# Altium schematic sheet 基于单片机的无线红外防盗报警系统.SchDoc
size A4
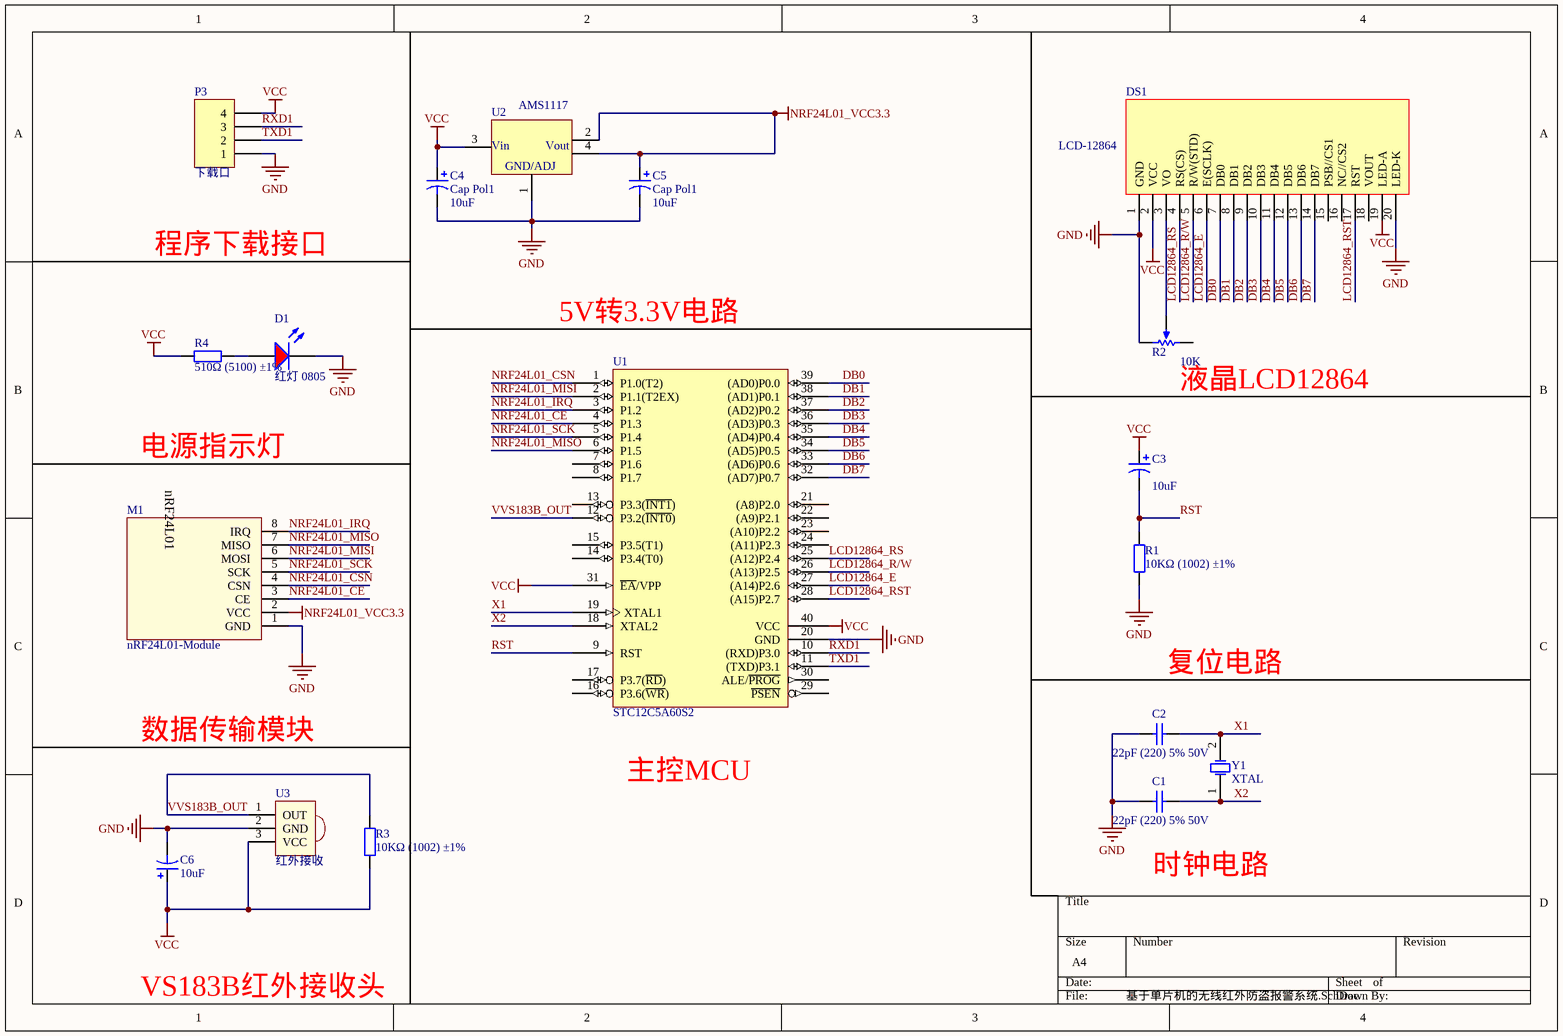
[diagram p0: 基于单片机的无线红外防盗报警系统.SchDoc]

## Parts
C1  22pF (220) 5% 50V  [LC-0805_C]
C2  22pF (220) 5% 50V  [LC-0805_C]
C3  value 10uF  [RB.2.5/.6.3mm]  (hidden comment: Cap Pol1)
C4  Cap Pol1  value 10uF  [RB.2.5/.6.3mm]
C5  Cap Pol1  value 10uF  [RB.2.5/.6.3mm]
C6  value 10uF  [RB.2.5/.6.3mm]  (hidden comment: Cap Pol1)
D1  红灯 0805  [LC-0805_LED_S1]
DS1  LCD-12864  [LCD-12864]
M1  nRF24L01-Module  [HDR2X4]
P3  下载口  [HDR1X4]
R1  10KΩ (1002) ±1%  [LC-0805_R]
R2  value 10K  [VR5]  (hidden comment: Pot)
R3  10KΩ (1002) ±1%  [LC-0805_R]
R4  510Ω (5100) ±1%  [LC-0805_R]
U1  STC12C5A60S2  [DIP40]
U2  AMS1117  [LC-SOT-223]
U3  红外接收  [HDR1X3]
Y1  XTAL  [R38]

## Nets
GND: C1.1 C2.1 C4.2 C5.2 C6.2 D1.K DS1.1(GND) DS1.20(LED-K) M1.1(GND) P3.1 R1.1 R2.2(BOT) U1.20(GND) U2.1 U3.2(GND)
NRF24L01_VCC3.3: C5.1 M1.2(VCC) U2.2 U2.4
VCC: C3.1 C4.1 C6.1 DS1.2(VCC) DS1.19(LED-A) P3.4 R3.1 R4.1 U1.31(~{EA}/VPP) U1.40(VCC) U2.3 U3.3(VCC)
DB0: DS1.7(DB0) U1.39((AD0)P0.0)
DB1: DS1.8(DB1) U1.38((AD1)P0.1)
DB2: DS1.9(DB2) U1.37((AD2)P0.2)
DB3: DS1.10(DB3) U1.36((AD3)P0.3)
DB4: DS1.11(DB4) U1.35((AD4)P0.4)
DB5: DS1.12(DB5) U1.34((AD5)P0.5)
DB6: DS1.13(DB6) U1.33((AD6)P0.6)
DB7: DS1.14(DB7) U1.32((AD7)P0.7)
LCD12864_E: DS1.6(E(SCLK)) U1.27((A14)P2.6)
LCD12864_R/W: DS1.5(R/W(STD)) U1.26((A13)P2.5)
LCD12864_RS: DS1.4(RS(CS)) U1.25((A12)P2.4)
LCD12864_RST: DS1.17(RST) U1.28((A15)P2.7)
NRF24L01_CE: M1.3(CE) U1.4(P1.3)
NRF24L01_CSN: M1.4(CSN) U1.1(P1.0(T2))
NRF24L01_IRQ: M1.8(IRQ) U1.3(P1.2)
NRF24L01_MISI: M1.6(MOSI) U1.2(P1.1(T2EX))
NRF24L01_MISO: M1.7(MISO) U1.6(P1.5)
NRF24L01_SCK: M1.5(SCK) U1.5(P1.4)
RST: C3.2 R1.2 U1.9(RST)
RXD1: P3.3 U1.10((RXD)P3.0)
TXD1: P3.2 U1.11((TXD)P3.1)
VVS183B_OUT: R3.2 U1.12(P3.2(~{INT0})) U3.1(OUT)
X1: C2.2 U1.19(XTAL1) Y1.2(OSC2)
X2: C1.2 U1.18(XTAL2) Y1.1(OSC1)
NetD1_A: D1.A R4.2
NetDS1_3: DS1.3(VO) R2.3(TAP)

Not connected (* = marked no-connect by the designer): DS1 15(PSB//CS1) 16(NC//CS2) 18(VOUT); R2 1(TOP); U1 7(P1.6) 8(P1.7) 13(P3.3(~{INT1})) 14(P3.4(T0)) 15(P3.5(T1)) 16(P3.6(~{WR})) 17(P3.7(~{RD})) 21((A8)P2.0) 22((A9)P2.1) 23((A10)P2.2) 24((A11)P2.3) 29(~{PSEN}) 30(ALE/~{PROG})

## Notes on the sheet
- 程序下载接口
- 5V转3.3V电路
- (near R2) 液晶LCD12864
- 电源指示灯
- 复位电路
- 数据传输模块
- 主控MCU
- 时钟电路
- VS183B红外接收头
- (in symbol AMS1117) Vin; Vout; GND/ADJ
- (in symbol nRF24L01-Module) nRF24L01

## Library data of the parts
C1 C2 = 0805 22pF (220) 5% 50V: 贴片电容; ComponentLink1Description: 供应商链接; ComponentLink1URL: http://www.szlcsc.com/product/details_2156.html; Package: 0805; Supplier: LC; SuppliersPartNumber: C1804
C3-C6 = Cap Pol1: Polarized Capacitor (Radial); Published: 8-Jun-2000; LatestRevisionDate: 17-Jul-2002; LatestRevisionNote: Re-released for DXP Platform.; PackageReference: RB7.6-15; Publisher: Altium Limited; PackageDescription: Polarized Capacitor (Radial); 2 Leads
D1 = 0805 红灯: 发光二极管; ComponentLink1Description: 供应商链接; ComponentLink1URL: http://www.szlcsc.com/product/details_2668.html; Package: 0805; Supplier: LC; SuppliersPartNumber: C2295
DS1 = LCD-12864: 带//不带字库
P3 = Header 4: Header, 4-Pin; LatestRevisionDate: 17-Jul-2002; LatestRevisionNote: Re-released for DXP Platform.; Publisher: Altium Limited
R1 R3 = 0805 10KΩ (1002) 1%: 贴片电阻; ComponentLink1Description: 供应商链接; ComponentLink1URL: http://www.szlcsc.com/product/details_18102.html; Package: 0805; Supplier: LC; SuppliersPartNumber: C17414
R2 = RPot: Potentiometer; Sim Note: Enter the Resistance value and the set point into parameter fields.; Set Position: 0.5; Published: 8-Jun-2000; LatestRevisionDate: 17-Jul-2002; LatestRevisionNote: Re-released for DXP Platform.; PackageReference: VR5; Publisher: Altium Limited; PackageDescription: Variable Resistor, Thru-Hole; 3 Leads
R4 = 0805 510Ω (5100) 1%: 贴片电阻; ComponentLink1Description: 供应商链接; ComponentLink1URL: http://www.szlcsc.com/product/details_18422.html; Package: 0805; Supplier: LC; SuppliersPartNumber: C17734
U1 = AT89C52: 8-Bit Microcontroller with 8K Flash ROM
U3 = 红外接收: VS838
Y1 = XTAL: Crystal Oscillator; Published: 8-Jun-2000; LatestRevisionDate: 17-Jul-2002; LatestRevisionNote: Re-released for DXP Platform.; PackageReference: R38; Publisher: Altium Limited; PackageDescription: Crystal, Thru-Hole; 2 Leads; Body 3.1 x 8.2 mm (Dia.xH)